# EAGLE design GarageDigitalClockDisplay (EAGLE 9.6.1)
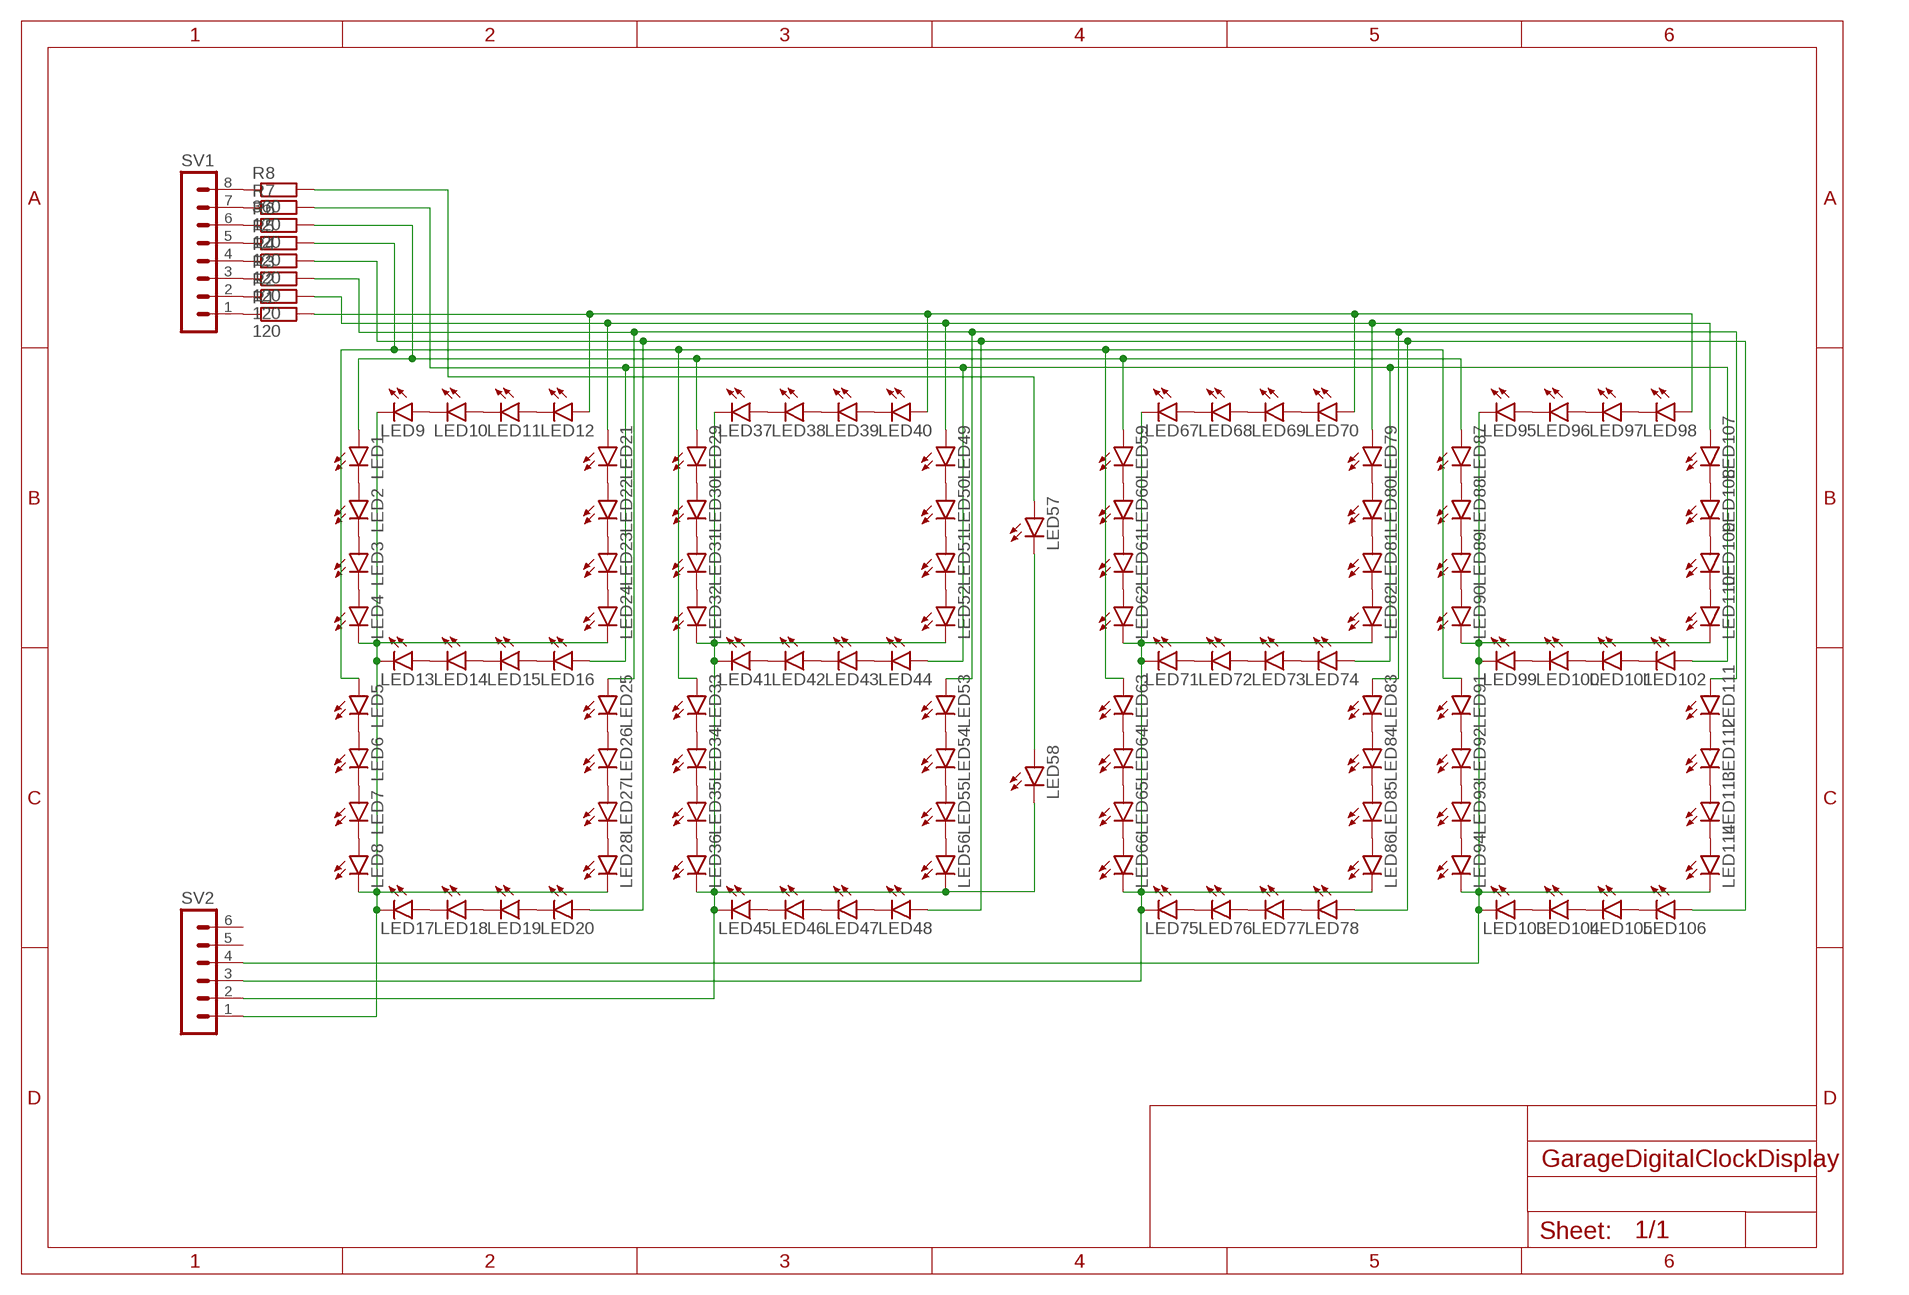
[diagram p0: schematic, sheet 1]

## Parts
LED1  LED5MM  [LED5MM]
LED2  LED5MM  [LED5MM]
LED3  LED5MM  [LED5MM]
LED4  LED5MM  [LED5MM]
LED5  LED5MM  [LED5MM]
LED6  LED5MM  [LED5MM]
LED7  LED5MM  [LED5MM]
LED8  LED5MM  [LED5MM]
LED9  LED5MM  [LED5MM]
LED10  LED5MM  [LED5MM]
LED11  LED5MM  [LED5MM]
LED12  LED5MM  [LED5MM]
LED13  LED5MM  [LED5MM]
LED14  LED5MM  [LED5MM]
LED15  LED5MM  [LED5MM]
LED16  LED5MM  [LED5MM]
LED17  LED5MM  [LED5MM]
LED18  LED5MM  [LED5MM]
LED19  LED5MM  [LED5MM]
LED20  LED5MM  [LED5MM]
LED21  LED5MM  [LED5MM]
LED22  LED5MM  [LED5MM]
LED23  LED5MM  [LED5MM]
LED24  LED5MM  [LED5MM]
LED25  LED5MM  [LED5MM]
LED26  LED5MM  [LED5MM]
LED27  LED5MM  [LED5MM]
LED28  LED5MM  [LED5MM]
LED29  LED5MM  [LED5MM]
LED30  LED5MM  [LED5MM]
LED31  LED5MM  [LED5MM]
LED32  LED5MM  [LED5MM]
LED33  LED5MM  [LED5MM]
LED34  LED5MM  [LED5MM]
LED35  LED5MM  [LED5MM]
LED36  LED5MM  [LED5MM]
LED37  LED5MM  [LED5MM]
LED38  LED5MM  [LED5MM]
LED39  LED5MM  [LED5MM]
LED40  LED5MM  [LED5MM]
LED41  LED5MM  [LED5MM]
LED42  LED5MM  [LED5MM]
LED43  LED5MM  [LED5MM]
LED44  LED5MM  [LED5MM]
LED45  LED5MM  [LED5MM]
LED46  LED5MM  [LED5MM]
LED47  LED5MM  [LED5MM]
LED48  LED5MM  [LED5MM]
LED49  LED5MM  [LED5MM]
LED50  LED5MM  [LED5MM]
LED51  LED5MM  [LED5MM]
LED52  LED5MM  [LED5MM]
LED53  LED5MM  [LED5MM]
LED54  LED5MM  [LED5MM]
LED55  LED5MM  [LED5MM]
LED56  LED5MM  [LED5MM]
LED57  LED5MM  [LED5MM]
LED58  LED5MM  [LED5MM]
LED59  LED5MM  [LED5MM]
LED60  LED5MM  [LED5MM]
LED61  LED5MM  [LED5MM]
LED62  LED5MM  [LED5MM]
LED63  LED5MM  [LED5MM]
LED64  LED5MM  [LED5MM]
LED65  LED5MM  [LED5MM]
LED66  LED5MM  [LED5MM]
LED67  LED5MM  [LED5MM]
LED68  LED5MM  [LED5MM]
LED69  LED5MM  [LED5MM]
LED70  LED5MM  [LED5MM]
LED71  LED5MM  [LED5MM]
LED72  LED5MM  [LED5MM]
LED73  LED5MM  [LED5MM]
LED74  LED5MM  [LED5MM]
LED75  LED5MM  [LED5MM]
LED76  LED5MM  [LED5MM]
LED77  LED5MM  [LED5MM]
LED78  LED5MM  [LED5MM]
LED79  LED5MM  [LED5MM]
LED80  LED5MM  [LED5MM]
LED81  LED5MM  [LED5MM]
LED82  LED5MM  [LED5MM]
LED83  LED5MM  [LED5MM]
LED84  LED5MM  [LED5MM]
LED85  LED5MM  [LED5MM]
LED86  LED5MM  [LED5MM]
LED87  LED5MM  [LED5MM]
LED88  LED5MM  [LED5MM]
LED89  LED5MM  [LED5MM]
LED90  LED5MM  [LED5MM]
LED91  LED5MM  [LED5MM]
LED92  LED5MM  [LED5MM]
LED93  LED5MM  [LED5MM]
LED94  LED5MM  [LED5MM]
LED95  LED5MM  [LED5MM]
LED96  LED5MM  [LED5MM]
LED97  LED5MM  [LED5MM]
LED98  LED5MM  [LED5MM]
LED99  LED5MM  [LED5MM]
LED100  LED5MM  [LED5MM]
LED101  LED5MM  [LED5MM]
LED102  LED5MM  [LED5MM]
LED103  LED5MM  [LED5MM]
LED104  LED5MM  [LED5MM]
LED105  LED5MM  [LED5MM]
LED106  LED5MM  [LED5MM]
LED107  LED5MM  [LED5MM]
LED108  LED5MM  [LED5MM]
LED109  LED5MM  [LED5MM]
LED110  LED5MM  [LED5MM]
LED111  LED5MM  [LED5MM]
LED112  LED5MM  [LED5MM]
LED113  LED5MM  [LED5MM]
LED114  LED5MM  [LED5MM]
R1  120  R-EU_0207/10  [0207/10]
R2  120  R-EU_0207/10  [0207/10]
R3  120  R-EU_0207/10  [0207/10]
R4  120  R-EU_0207/10  [0207/10]
R5  120  R-EU_0207/10  [0207/10]
R6  120  R-EU_0207/10  [0207/10]
R7  120  R-EU_0207/10  [0207/10]
R8  360  R-EU_0207/10  [0207/10]
SV1  MA08-1  [MA08-1]
SV2  MA06-1  [MA06-1]

## Nets
N$1: LED1.K(C) LED2.A
N$2: LED2.K(C) LED3.A
N$3: LED3.K(C) LED4.A
N$4: LED5.K(C) LED6.A
N$5: LED6.K(C) LED7.A
N$6: LED7.K(C) LED8.A
N$7: LED9.A LED10.K(C)
N$8: LED10.A LED11.K(C)
N$9: LED11.A LED12.K(C)
N$10: LED13.A LED14.K(C)
N$11: LED14.A LED15.K(C)
N$12: LED15.A LED16.K(C)
N$13: LED17.A LED18.K(C)
N$14: LED18.A LED19.K(C)
N$15: LED19.A LED20.K(C)
N$16: LED21.K(C) LED22.A
N$17: LED22.K(C) LED23.A
N$18: LED23.K(C) LED24.A
N$19: LED25.K(C) LED26.A
N$20: LED26.K(C) LED27.A
N$21: LED27.K(C) LED28.A
N$22: R1.1 SV1.1
N$23: LED1.A LED29.A LED59.A LED87.A R6.2
N$24: LED5.A LED33.A LED63.A LED91.A R5.2
N$25: LED20.A LED48.A LED78.A LED106.A R4.2
N$26: R2.1 SV1.2
N$27: LED21.A LED49.A LED79.A LED107.A R2.2
N$28: R3.1 SV1.3
N$29: LED4.K(C) LED8.K(C) LED9.K(C) LED13.K(C) LED17.K(C) LED24.K(C) LED28.K(C) SV2.1
N$30: LED29.K(C) LED30.A
N$31: LED30.K(C) LED31.A
N$32: LED31.K(C) LED32.A
N$33: LED33.K(C) LED34.A
N$34: LED34.K(C) LED35.A
N$35: LED35.K(C) LED36.A
N$36: LED37.A LED38.K(C)
N$37: LED38.A LED39.K(C)
N$38: LED39.A LED40.K(C)
N$39: LED41.A LED42.K(C)
N$40: LED42.A LED43.K(C)
N$41: LED43.A LED44.K(C)
N$42: LED45.A LED46.K(C)
N$43: LED46.A LED47.K(C)
N$44: LED47.A LED48.K(C)
N$45: LED49.K(C) LED50.A
N$46: LED50.K(C) LED51.A
N$47: LED51.K(C) LED52.A
N$48: LED53.K(C) LED54.A
N$49: LED54.K(C) LED55.A
N$50: LED55.K(C) LED56.A
N$51: R4.1 SV1.4
N$52: R5.1 SV1.5
N$53: R6.1 SV1.6
N$54: R7.1 SV1.7
N$55: R8.1 SV1.8
N$58: LED32.K(C) LED36.K(C) LED37.K(C) LED41.K(C) LED45.K(C) LED52.K(C) LED56.K(C) LED58.K(C) SV2.2
N$59: LED57.K(C) LED58.A
N$60: LED57.A R8.2
N$61: LED59.K(C) LED60.A
N$62: LED60.K(C) LED61.A
N$63: LED61.K(C) LED62.A
N$64: LED63.K(C) LED64.A
N$65: LED64.K(C) LED65.A
N$66: LED65.K(C) LED66.A
N$67: LED67.A LED68.K(C)
N$68: LED68.A LED69.K(C)
N$69: LED69.A LED70.K(C)
N$70: LED71.A LED72.K(C)
N$71: LED72.A LED73.K(C)
N$72: LED73.A LED74.K(C)
N$73: LED75.A LED76.K(C)
N$74: LED76.A LED77.K(C)
N$75: LED77.A LED78.K(C)
N$76: LED79.K(C) LED80.A
N$77: LED80.K(C) LED81.A
N$78: LED81.K(C) LED82.A
N$79: LED83.K(C) LED84.A
N$80: LED84.K(C) LED85.A
N$81: LED85.K(C) LED86.A
N$89: LED62.K(C) LED66.K(C) LED67.K(C) LED71.K(C) LED75.K(C) LED82.K(C) LED86.K(C) SV2.3
N$90: LED87.K(C) LED88.A
N$91: LED88.K(C) LED89.A
N$92: LED89.K(C) LED90.A
N$93: LED91.K(C) LED92.A
N$94: LED92.K(C) LED93.A
N$95: LED93.K(C) LED94.A
N$96: LED95.A LED96.K(C)
N$97: LED96.A LED97.K(C)
N$98: LED97.A LED98.K(C)
N$99: LED99.A LED100.K(C)
N$100: LED100.A LED101.K(C)
N$101: LED101.A LED102.K(C)
N$102: LED103.A LED104.K(C)
N$103: LED104.A LED105.K(C)
N$104: LED105.A LED106.K(C)
N$105: LED107.K(C) LED108.A
N$106: LED108.K(C) LED109.A
N$107: LED109.K(C) LED110.A
N$108: LED111.K(C) LED112.A
N$109: LED112.K(C) LED113.A
N$110: LED113.K(C) LED114.A
N$111: LED16.A LED44.A LED74.A LED102.A R7.2
N$115: LED25.A LED53.A LED83.A LED111.A R3.2
N$117: LED12.A LED40.A LED70.A LED98.A R1.2
N$118: LED90.K(C) LED94.K(C) LED95.K(C) LED99.K(C) LED103.K(C) LED110.K(C) LED114.K(C) SV2.4
Unconnected: SV2.5 SV2.6

## Library data of the parts
LED1-LED114 = led:LED: LED OSRAM: - CHIPLED LG R971, LG N971, LY N971, LG Q971, LY Q971, LO R971, LY R971 LH N974, LH R974 LS Q976, LO Q976, LY Q976 LO Q996 - Hyper CHIPLED LW Q18S LB Q993, LB Q99A, LB R99A - SideLED LS A670, LO A670, LY A670, LG A670, LP A670 LB A673, LV A673, LT A673, LW A673 LH A674 LY A675 LS A676, LA A676, LO A676, LY A676, LW A676 LS A679, LY A679, LG A679 - Hyper Micro SIDELED® LS Y876, LA Y876, LO Y876, LY Y876 LT Y87S - SmartLED LW L88C, LW L88S LB L89C, LB L89S, LG L890 LS L89K, LO L89K, LY L89K LS L896, LA L896, LO L896, LY L896 - TOPLED LS T670, LO T670, LY T670, LG T670, LP T670 LSG T670, LSP T670, LSY T670, LOP T670, LYG T670 LG T671, LOG T671, LSG T671 LB T673, LV T673, LT T673, LW T673 LH T674 LS T676, LA T676, LO T676, LY T676, LB T676, LH T676, LSB T676, LW T676 LB T67C, LV T67C, LT T67C, LS T67K, LO T67K, LY T67K, LW E67C LS E67B, LA E67B, LO E67B, LY E67B, LB E67C, LV E67C, LT E67C LW T67C LS T679, LY T679, LG T679 LS T770, LO T770, LY T770, LG T770, LP T770 LB T773, LV T773, LT T773, LW T773 LH T774 LS E675, LA E675, LY E675, LS T675 LS T776, LA T776, LO T776, LY T776, LB T776 LHGB T686 LT T68C, LB T68C - Hyper Mini TOPLED® LB M676 - Mini TOPLED Santana® LG M470 LS M47K, LO M47K, LY M47K Source: http://www.osram.convergy.de LUXEON: - LUMILED® LXK2-PW12-R00, LXK2-PW12-S00, LXK2-PW14-U00, LXK2-PW14-V00 LXK2-PM12-R00, LXK2-PM12-S00, LXK2-PM14-U00 LXK2-PE12-Q00, LXK2-PE12-R00, LXK2-PE12-S00, LXK2-PE14-T00, LXK2-PE14-U00 LXK2-PB12-K00, LXK2-PB12-L00, LXK2-PB12-M00, LXK2-PB14-N00, LXK2-PB14-P00, LXK2-PB14-Q00 LXK2-PR12-L00, LXK2-PR12-M00, LXK2-PR14-Q00, LXK2-PR14-R00 LXK2-PD12-Q00, LXK2-PD12-R00, LXK2-PD12-S00 LXK2-PH12-R00, LXK2-PH12-S00 LXK2-PL12-P00, LXK2-PL12-Q00, LXK2-PL12-R00 Source: www.luxeon.com KINGBRIGHT: KA-3528ASYC Source: www.kingbright.com
R1-R8 = rcl:R-EU_: RESISTOR, European symbol; SPICEPREFIX: R
SV1 = con-lstb:MA08-1: PIN HEADER; OC_FARNELL: unknown; OC_NEWARK: unknown
SV2 = con-lstb:MA06-1: PIN HEADER; OC_FARNELL: unknown; OC_NEWARK: unknown

## Board
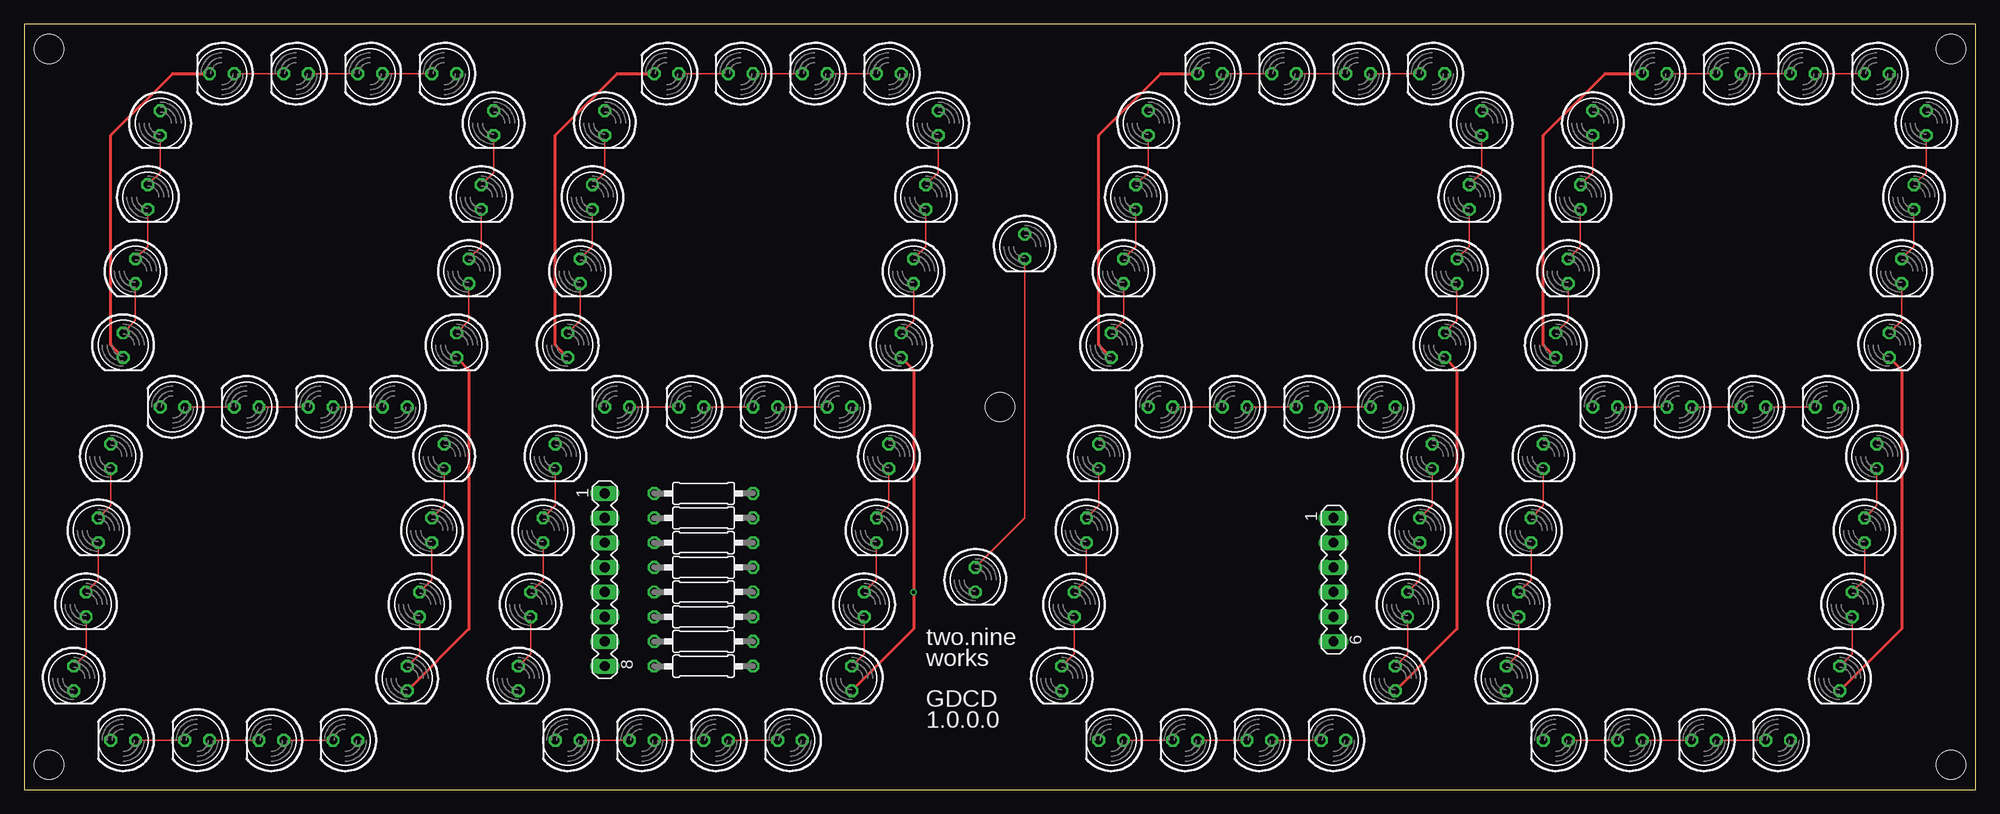
[diagram p1: board, top side]
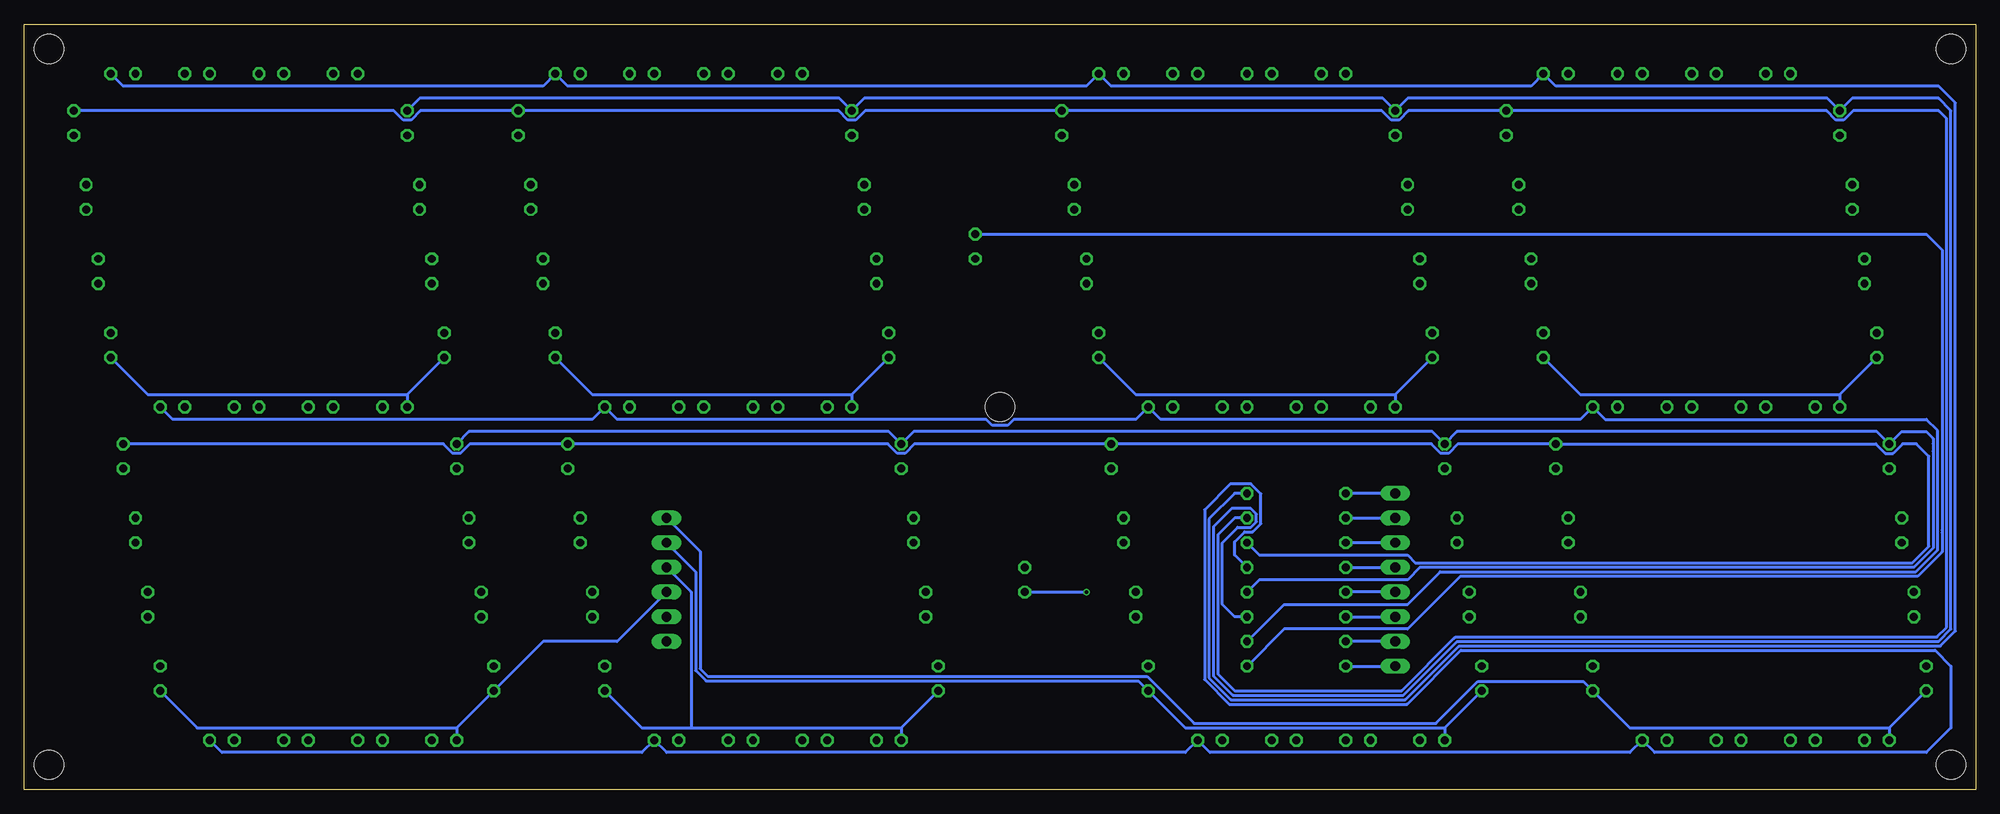
[diagram p2: board, bottom side, seen from below]

Size 200.66 x 78.74 mm. Coordinates in mm from the lower left corner, seen from the top.
Outline: 0,0 200.66,0 200.66,78.74 0,78.74 0,0
Copper layers (1*16): Top 0.035mm / dielectric 1.5mm / Bottom 0.035mm
Design rules "SeeedStudio_2layer_DRU_no_angle_20140221": minimum track width 6mil, minimum drill 12mil, track to track 6mil, track to pad 6mil, pad to pad 6mil, via to via 6mil, smd to smd 0mil, copper to edge 10mil, drill to drill 10mil, minimum pad ring 10mil, minimum via ring 6mil, stop-mask expansion 2mil, vias tented up to drill 100mil, thermal gap 10mil
Holes 3 mm at 2.54,76.2 2.54,2.54 198.12,76.2 198.12,2.54 100.33,39.37

### Footprints (pad centres in the part's own frame; a part is rotated, then mirrored left to right if it is on the bottom)
LED5MM = drill 0.813 octagon: A -1.27,0; K 1.27,0
0207/10 = drill 0.813 octagon: 1 -5.08,0; 2 5.08,0
MA08-1 = drill 1.016 long: 1 -8.89,0; 2 -6.35,0; 3 -3.81,0; 4 -1.27,0; 5 1.27,0; 6 3.81,0; 7 6.35,0; 8 8.89,0
MA06-1 = drill 1.016 long: 1 -6.35,0; 2 -3.81,0; 3 -1.27,0; 4 1.27,0; 5 3.81,0; 6 6.35,0

### Placement (x,y rotation side)
LED1  13.97,68.58 270 top
LED2  12.7,60.96 270 top
LED3  11.43,53.34 270 top
LED4  10.16,45.72 270 top
LED5  8.89,34.29 270 top
LED6  7.62,26.67 270 top
LED7  6.35,19.05 270 top
LED8  5.08,11.43 270 top
LED9  20.32,73.66 180 top
LED10  27.94,73.66 180 top
LED11  35.56,73.66 180 top
LED12  43.18,73.66 180 top
LED13  15.24,39.37 180 top
LED14  22.86,39.37 180 top
LED15  30.48,39.37 180 top
LED16  38.1,39.37 180 top
LED17  10.16,5.08 180 top
LED18  17.78,5.08 180 top
LED19  25.4,5.08 180 top
LED20  33.02,5.08 180 top
LED21  48.26,68.58 270 top
LED22  46.99,60.96 270 top
LED23  45.72,53.34 270 top
LED24  44.45,45.72 270 top
LED25  43.18,34.29 270 top
LED26  41.91,26.67 270 top
LED27  40.64,19.05 270 top
LED28  39.37,11.43 270 top
LED29  59.69,68.58 270 top
LED30  58.42,60.96 270 top
LED31  57.15,53.34 270 top
LED32  55.88,45.72 270 top
LED33  54.61,34.29 270 top
LED34  53.34,26.67 270 top
LED35  52.07,19.05 270 top
LED36  50.8,11.43 270 top
LED37  66.04,73.66 180 top
LED38  73.66,73.66 180 top
LED39  81.28,73.66 180 top
LED40  88.9,73.66 180 top
LED41  60.96,39.37 180 top
LED42  68.58,39.37 180 top
LED43  76.2,39.37 180 top
LED44  83.82,39.37 180 top
LED45  55.88,5.08 180 top
LED46  63.5,5.08 180 top
LED47  71.12,5.08 180 top
LED48  78.74,5.08 180 top
LED49  93.98,68.58 270 top
LED50  92.71,60.96 270 top
LED51  91.44,53.34 270 top
LED52  90.17,45.72 270 top
LED53  88.9,34.29 270 top
LED54  87.63,26.67 270 top
LED55  86.36,19.05 270 top
LED56  85.09,11.43 270 top
LED57  102.87,55.88 270 top
LED58  97.79,21.59 270 top
LED59  115.57,68.58 270 top
LED60  114.3,60.96 270 top
LED61  113.03,53.34 270 top
LED62  111.76,45.72 270 top
LED63  110.49,34.29 270 top
LED64  109.22,26.67 270 top
LED65  107.95,19.05 270 top
LED66  106.68,11.43 270 top
LED67  121.92,73.66 180 top
LED68  129.54,73.66 180 top
LED69  137.16,73.66 180 top
LED70  144.78,73.66 180 top
LED71  116.84,39.37 180 top
LED72  124.46,39.37 180 top
LED73  132.08,39.37 180 top
LED74  139.7,39.37 180 top
LED75  111.76,5.08 180 top
LED76  119.38,5.08 180 top
LED77  127,5.08 180 top
LED78  134.62,5.08 180 top
LED79  149.86,68.58 270 top
LED80  148.59,60.96 270 top
LED81  147.32,53.34 270 top
LED82  146.05,45.72 270 top
LED83  144.78,34.29 270 top
LED84  143.51,26.67 270 top
LED85  142.24,19.05 270 top
LED86  140.97,11.43 270 top
LED87  161.29,68.58 270 top
LED88  160.02,60.96 270 top
LED89  158.75,53.34 270 top
LED90  157.48,45.72 270 top
LED91  156.21,34.29 270 top
LED92  154.94,26.67 270 top
LED93  153.67,19.05 270 top
LED94  152.4,11.43 270 top
LED95  167.64,73.66 180 top
LED96  175.26,73.66 180 top
LED97  182.88,73.66 180 top
LED98  190.5,73.66 180 top
LED99  162.56,39.37 180 top
LED100  170.18,39.37 180 top
LED101  177.8,39.37 180 top
LED102  185.42,39.37 180 top
LED103  157.48,5.08 180 top
LED104  165.1,5.08 180 top
LED105  172.72,5.08 180 top
LED106  180.34,5.08 180 top
LED107  195.58,68.58 270 top
LED108  194.31,60.96 270 top
LED109  193.04,53.34 270 top
LED110  191.77,45.72 270 top
LED111  190.5,34.29 270 top
LED112  189.23,26.67 270 top
LED113  187.96,19.05 270 top
LED114  186.69,11.43 270 top
R1  69.85,30.48 0 top
R2  69.85,27.94 0 top
R3  69.85,25.4 0 top
R4  69.85,22.86 0 top
R5  69.85,20.32 0 top
R6  69.85,17.78 0 top
R7  69.85,15.24 0 top
R8  69.85,12.7 0 top
SV1  59.69,21.59 270 top
SV2  134.62,21.59 270 top

### Tracks (layer width: path | path; a pad name or v marks a point on that pad's centre or on a via)
N$1
  Top 0.152: LED1.K 13.97,63.5 LED2.A
N$2
  Top 0.152: LED2.K 12.7,55.88 LED3.A
N$3
  Top 0.152: LED3.K 11.43,48.26 LED4.A
N$4
  Top 0.152: LED5.K 8.89,29.21 LED6.A
N$5
  Top 0.152: LED6.K 7.62,21.59 LED7.A
N$6
  Top 0.152: LED7.K 6.35,13.97 LED8.A
N$7
  Top 0.152: LED9.A LED10.K
N$8
  Top 0.152: LED10.A LED11.K
N$9
  Top 0.152: LED11.A LED12.K
N$10
  Top 0.152: LED14.K LED13.A
N$11
  Top 0.152: LED15.K LED14.A
N$12
  Top 0.152: LED16.K LED15.A
N$13
  Top 0.152: LED17.A LED18.K
N$14
  Top 0.152: LED18.A LED19.K
N$15
  Top 0.152: LED19.A LED20.K
N$16
  Top 0.152: LED21.K 48.26,63.5 LED22.A
N$17
  Top 0.152: LED22.K 46.99,55.88 LED23.A
N$18
  Top 0.152: LED23.K 45.72,48.26 LED24.A
N$19
  Top 0.152: LED25.K 43.18,29.21 LED26.A
N$20
  Top 0.152: LED26.K 41.91,21.59 LED27.A
N$21
  Top 0.152: LED27.K 40.64,13.97 LED28.A
N$22
  Bottom 0.305: SV1.1 R1.1
N$23
  Bottom 0.305: LED87.A 160.02,71.12 116.84,71.12 LED59.A 114.3,71.12 60.96,71.12 LED29.A 58.42,71.12 15.24,71.12 LED1.A 12.7,71.12 3.81,71.12 2.54,69.85 2.54,16.51 3.81,15.24 53.32,15.24 58.85,9.7 76.39,9.7 78.38,11.7 78.38,27.03 76.5,28.91 74.53,28.91 73.97,28.34 73.97,27.54 74.53,26.98 75.89,26.98 77.47,25.4 77.47,19.05 76.2,17.78 R6.2
N$24
  Bottom 0.305: LED91.A 154.94,36.83 111.76,36.83 LED63.A 109.22,36.83 55.88,36.83 LED33.A 53.34,36.83 10.16,36.83 LED5.A 7.62,36.83 5.08,36.83 4.37,36.12 4.37,35.56 4.37,34.8 4.37,24.84 6.35,22.86 57.15,22.86 58.42,21.59 73.66,21.59 R5.2
N$25
  Bottom 0.305: LED106.A 180.34,3.81 137.16,3.81 LED78.A 134.62,3.81 81.28,3.81 LED48.A 78.74,3.81 35.56,3.81 LED20.A 33.02,3.81 5.08,3.81 2.54,6.35 2.54,12.7 4.17,14.33 52.94,14.33 58.48,8.79 76.77,8.79 79.3,11.32 79.3,28.79 76.64,31.45 74.53,31.45 73.51,30.42 73.51,27.35 74.34,26.52 75.18,26.52 76.2,25.5 76.2,24.13 R4.2
N$26
  Bottom 0.305: R2.1 SV1.2
N$27
  Bottom 0.305: LED107.A 162.66,69.85 161.69,68.89 160.89,68.89 159.93,69.85 LED79.A 116.94,69.85 115.97,68.89 115.17,68.89 114.2,69.85 LED49.A 61.05,69.85 60.09,68.89 59.29,68.89 58.33,69.85 LED21.A 15.34,69.85 14.37,68.89 13.57,68.89 12.61,69.85 3.81,69.85 3,69.04 3,16.7 4,15.7 53.51,15.7 53.61,15.6 53.65,15.55 59.04,10.16 76.2,10.16 77.93,11.89 77.93,26.21 76.2,27.94 R2.2
N$28
  Bottom 0.305: SV1.3 R3.1
N$29
  Top 0.305: LED24.K 45.72,43.18 45.72,16.51 LED28.K | LED4.K 8.89,45.72 8.89,67.31 15.24,73.66 LED9.K
  Bottom 0.305: LED4.K 13.97,40.64 | 13.97,40.64 LED13.K | LED24.K 40.64,40.64 13.97,40.64 | LED8.K 8.89,6.35 | 8.89,6.35 LED17.K | 8.89,6.35 35.56,6.35 LED28.K 40.34,11.12 51.2,11.12 55.52,6.81 80.37,6.81 85.2,11.63 130.37,11.63 130.87,12.13 131.12,12.39 131.17,12.43 131.17,24.49 SV2.1
N$30
  Top 0.152: LED29.K 59.69,63.5 LED30.A
N$31
  Top 0.152: LED30.K 58.42,55.88 LED31.A
N$32
  Top 0.152: LED31.K 57.15,48.26 LED32.A
N$33
  Top 0.152: LED33.K 54.61,29.21 LED34.A
N$34
  Top 0.152: LED34.K 53.34,21.59 LED35.A
N$35
  Top 0.152: LED35.K 52.07,13.97 LED36.A
N$36
  Top 0.152: LED37.A LED38.K
N$37
  Top 0.152: LED38.A LED39.K
N$38
  Top 0.152: LED39.A LED40.K
N$39
  Top 0.152: LED41.A LED42.K
N$40
  Top 0.152: LED42.A LED43.K
N$41
  Top 0.152: LED43.A LED44.K
N$42
  Top 0.152: LED45.A LED46.K
N$43
  Top 0.152: LED46.A LED47.K
N$44
  Top 0.152: LED47.A LED48.K
N$45
  Top 0.152: LED49.K 93.98,63.5 LED50.A
N$46
  Top 0.152: LED50.K 92.71,55.88 LED51.A
N$47
  Top 0.152: LED51.K 91.44,48.26 LED52.A
N$48
  Top 0.152: LED53.K 88.9,29.21 LED54.A
N$49
  Top 0.152: LED54.K 87.63,21.59 LED55.A
N$50
  Top 0.152: LED55.K 86.36,13.97 LED56.A
N$51
  Bottom 0.305: R4.1 SV1.4
N$52
  Bottom 0.305: SV1.5 R5.1
N$53
  Bottom 0.305: R6.1 SV1.6
N$54
  Bottom 0.305: SV1.7 R7.1
N$55
  Bottom 0.305: R8.1 SV1.8
N$58  (via drill 0.35)
  Top 0.305: LED52.K 91.44,43.18 v91.44,20.32 91.44,16.51 LED56.K | LED32.K 54.61,45.72 54.61,67.31 60.96,73.66 LED37.K
  Bottom 0.305: LED32.K 59.69,40.64 | 59.69,40.64 LED41.K | LED52.K 86.36,40.64 59.69,40.64 | LED36.K 54.61,6.35 | 54.61,6.35 LED45.K | 54.61,6.35 81.28,6.35 LED56.K 86.11,11.18 130.56,11.18 131.62,12.24 131.62,22.4 SV2.2 | LED58.K v91.44,20.32
N$59
  Top 0.152: LED57.K 102.87,27.94 LED58.A
N$60
  Bottom 0.305: LED57.A 5.08,57.15 3.45,55.52 3.45,26.67 3.45,26.42 3.45,24.46 5.97,21.95 52.98,21.95 58.42,16.51 71.12,16.51 R8.2
N$61
  Top 0.152: LED59.K 115.57,63.5 LED60.A
N$62
  Top 0.152: LED60.K 114.3,55.88 LED61.A
N$63
  Top 0.152: LED61.K 113.03,48.26 LED62.A
N$64
  Top 0.152: LED63.K 110.49,29.21 LED64.A
N$65
  Top 0.152: LED64.K 109.22,21.59 LED65.A
N$66
  Top 0.152: LED65.K 107.95,13.97 LED66.A
N$67
  Top 0.152: LED67.A LED68.K
N$68
  Top 0.152: LED68.A LED69.K
N$69
  Top 0.152: LED69.A LED70.K
N$70
  Top 0.152: LED72.K LED71.A
N$71
  Top 0.152: LED73.K LED72.A
N$72
  Top 0.152: LED74.K LED73.A
N$73
  Top 0.152: LED75.A LED76.K
N$74
  Top 0.152: LED76.A LED77.K
N$75
  Top 0.152: LED77.A LED78.K
N$76
  Top 0.152: LED79.K 149.86,63.5 LED80.A
N$77
  Top 0.152: LED80.K 148.59,55.88 LED81.A
N$78
  Top 0.152: LED81.K 147.32,48.26 LED82.A
N$79
  Top 0.152: LED83.K 144.78,29.21 LED84.A
N$80
  Top 0.152: LED84.K 143.51,21.59 LED85.A
N$81
  Top 0.152: LED85.K 142.24,13.97 LED86.A
N$89
  Top 0.305: LED82.K 147.32,43.18 147.32,16.51 LED86.K | LED62.K 110.49,45.72 110.49,67.31 116.84,73.66 LED67.K
  Bottom 0.305: LED62.K 115.57,40.64 | 115.57,40.64 LED71.K | LED82.K 142.24,40.64 115.57,40.64 | LED66.K 110.49,6.35 | 110.49,6.35 LED75.K | LED86.K 137.16,6.35 132.08,6.35 | 132.08,6.35 110.49,6.35 | SV2.3 132.08,20.32 132.08,6.35
N$90
  Top 0.152: LED87.K 161.29,63.5 LED88.A
N$91
  Top 0.152: LED88.K 160.02,55.88 LED89.A
N$92
  Top 0.152: LED89.K 158.75,48.26 LED90.A
N$93
  Top 0.152: LED91.K 156.21,29.21 LED92.A
N$94
  Top 0.152: LED92.K 154.94,21.59 LED93.A
N$95
  Top 0.152: LED93.K 153.67,13.97 LED94.A
N$96
  Top 0.152: LED95.A LED96.K
N$97
  Top 0.152: LED96.A LED97.K
N$98
  Top 0.152: LED97.A LED98.K
N$99
  Top 0.152: LED99.A LED100.K
N$100
  Top 0.152: LED100.A LED101.K
N$101
  Top 0.152: LED101.A LED102.K
N$102
  Top 0.152: LED103.A LED104.K
N$103
  Top 0.152: LED104.A LED105.K
N$104
  Top 0.152: LED105.A LED106.K
N$105
  Top 0.152: LED107.K 195.58,63.5 LED108.A
N$106
  Top 0.152: LED108.K 194.31,55.88 LED109.A
N$107
  Top 0.152: LED109.K 193.04,48.26 LED110.A
N$108
  Top 0.152: LED111.K 190.5,29.21 LED112.A
N$109
  Top 0.152: LED112.K 189.23,21.59 LED113.A
N$110
  Top 0.152: LED113.K 187.96,13.97 LED114.A
N$111
  Bottom 0.305: LED102.A 185.42,38.1 142.24,38.1 LED74.A 139.7,38.1 101.76,38.1 101.12,37.46 99.54,37.46 98.9,38.1 86.36,38.1 LED44.A 83.82,38.1 40.64,38.1 LED16.A 38.1,38.1 5.08,38.1 3.91,36.93 3.91,24.65 6.16,22.4 55.07,22.4 58.42,19.05 71.12,19.05 R7.2
N$115
  Bottom 0.305: LED111.A 157.57,35.56 156.61,34.59 155.81,34.59 154.84,35.56 LED83.A 111.86,35.56 110.89,34.59 110.09,34.59 109.12,35.56 LED53.A 55.98,35.56 55.01,34.59 54.21,34.59 53.24,35.56 LED25.A 10.26,35.56 9.29,34.59 8.49,34.59 7.53,35.56 6.1,35.56 4.83,34.29 4.83,25.03 6.54,23.32 57.61,23.32 58.42,24.13 73.66,24.13 R3.2
N$117
  Bottom 0.305: LED98.A 190.5,72.39 147.32,72.39 LED70.A 144.78,72.39 91.44,72.39 LED40.A 88.9,72.39 45.72,72.39 LED12.A 43.18,72.39 3.81,72.39 2.08,70.66 2.08,16.32 3.62,14.78 53.13,14.78 58.66,9.25 76.58,9.25 78.84,11.51 78.84,27.84 76.2,30.48 R1.2
N$118
  Top 0.305: LED110.K 193.04,43.18 193.04,16.51 LED114.K | LED90.K 156.21,45.72 156.21,67.31 162.56,73.66 LED95.K
  Bottom 0.305: 156.21,6.35 LED94.K 147.32,15.24 139.7,15.24 SV2.4 | 156.21,6.35 LED103.K | LED114.K 182.88,6.35 156.21,6.35 | LED90.K 161.29,40.64 | 161.29,40.64 LED99.K | LED110.K 187.96,40.64 161.29,40.64

### Text on the board
tPlace: two.nine / works | GDCD / 1.0.0.0